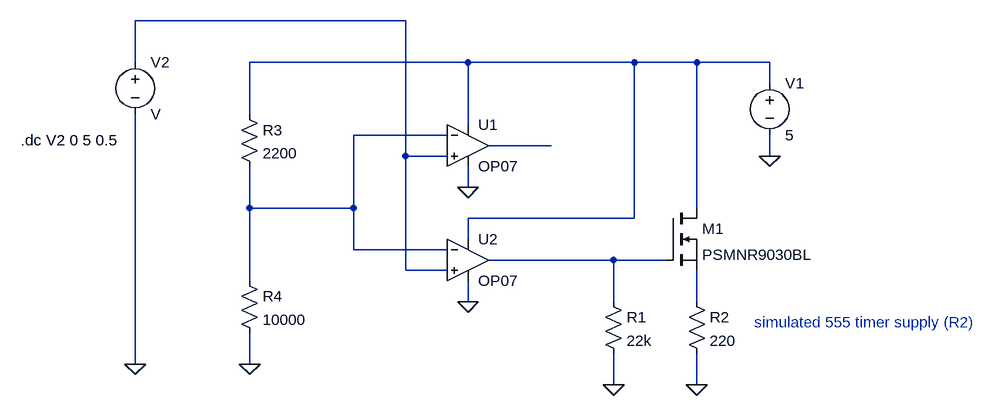
[diagram p0: schematic TSAL_logic.asc]
TSAL_logic.asc, the LTspice schematic file:
Version 4
SHEET 1 1032 680
WIRE 112 -96 -304 -96
WIRE -304 -32 -304 -96
WIRE 208 -32 -128 -32
WIRE 464 -32 208 -32
WIRE 560 -32 464 -32
WIRE 672 -32 560 -32
WIRE 672 0 672 -32
WIRE -128 48 -128 -32
WIRE 208 64 208 -32
WIRE 176 80 32 80
WIRE 336 96 240 96
WIRE 112 112 112 -96
WIRE 176 112 112 112
WIRE 672 112 672 80
WIRE 208 160 208 128
WIRE -128 192 -128 128
WIRE 32 192 32 80
WIRE 32 192 -128 192
WIRE 560 192 560 -32
WIRE 464 208 464 -32
WIRE 464 208 208 208
WIRE 208 240 208 208
WIRE 32 256 32 192
WIRE 176 256 32 256
WIRE 432 272 240 272
WIRE 512 272 432 272
WIRE 112 288 112 112
WIRE 176 288 112 288
WIRE -128 304 -128 192
WIRE 208 336 208 304
WIRE 432 336 432 272
WIRE 560 336 560 288
WIRE -304 432 -304 48
WIRE -128 432 -128 384
WIRE 432 464 432 416
WIRE 560 464 560 416
FLAG 208 160 0
FLAG 208 336 0
FLAG 432 464 0
FLAG 560 464 0
FLAG 672 112 0
FLAG -128 432 0
FLAG -304 432 0
SYMBOL OpAmps\\OP07 208 32 R0
SYMATTR InstName U1
SYMBOL OpAmps\\OP07 208 208 R0
SYMATTR InstName U2
SYMBOL res 416 320 R0
SYMATTR InstName R1
SYMATTR Value 22k
SYMBOL nmos 512 192 R0
SYMATTR InstName M1
SYMATTR Value PSMNR9030BL
SYMBOL res 544 320 R0
SYMATTR InstName R2
SYMATTR Value 220
SYMBOL voltage 672 -16 R0
WINDOW 123 0 0 Left 0
WINDOW 39 0 0 Left 0
SYMATTR InstName V1
SYMATTR Value 5
SYMBOL res -144 32 R0
SYMATTR InstName R3
SYMATTR Value 2200
SYMBOL res -144 288 R0
SYMATTR InstName R4
SYMATTR Value 10000
SYMBOL voltage -304 -48 R0
SYMATTR InstName V2
TEXT 648 368 Left 2 ;simulated 555 timer supply (R2)
TEXT -480 88 Left 2 !.dc V2 0 5 0.5

The netlist it stands for:
* TSAL_logic.asc
XU1 N001 N003 N002 0 N004 LT1001  ; OP07, pins In+ In- V+ V- OUT
XU2 N001 N003 N002 0 N005 LT1001  ; OP07, pins In+ In- V+ V- OUT
R1 N005 0 22k
M1 N002 N005 N006 N006 PSMNR9030BL
R2 N006 0 220
V1 N002 0 5
R3 N002 N003 2200
R4 N003 0 10000
V2 N001 0 V
.model NMOS NMOS
.model PMOS PMOS
.lib standard.mos
* simulated 555 timer supply (R2)
.dc V2 0 5 0.5
.lib LTC.lib
.backanno
.end